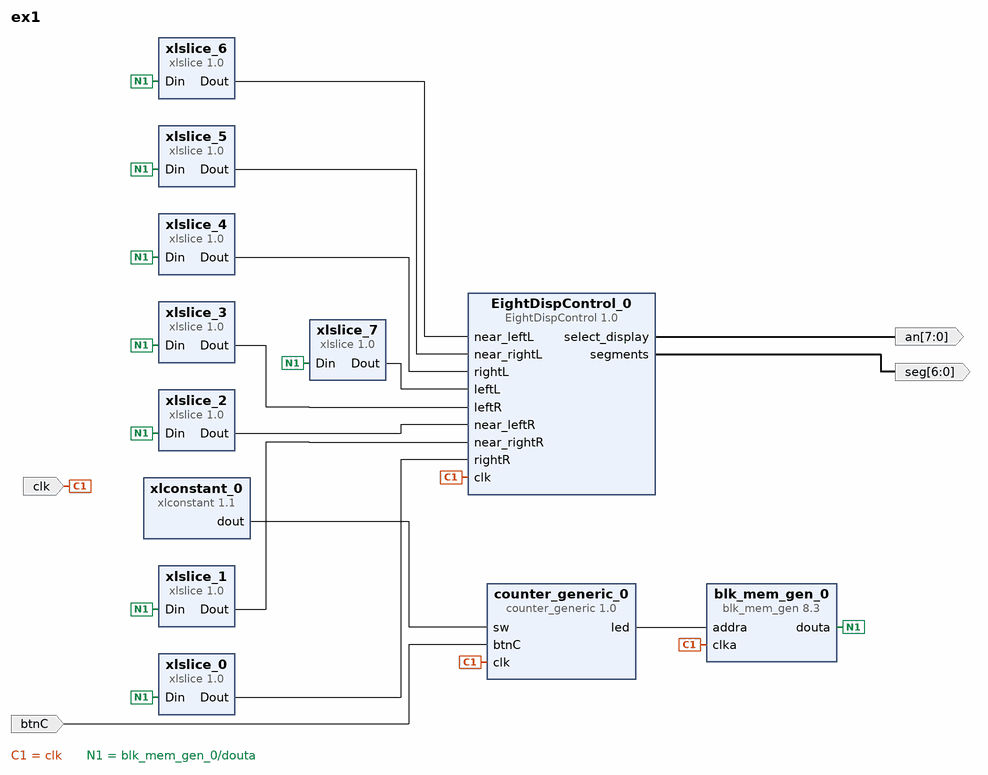
[diagram p0: block diagram of the top level]
# Vivado block design ex1, xc7a100tcsg324-3, Vivado 2016.4
create_bd_design ex1

create_bd_port -dir I clk
create_bd_port -dir I btnC
create_bd_port -dir O -from 6 -to 0 seg
create_bd_port -dir O -from 7 -to 0 an

create_bd_cell -type ip -vlnv xilinx.com:ip:blk_mem_gen:8.3 blk_mem_gen_0
set_property -dict [list \
  CONFIG.Memory_Type Single_Port_ROM \
  CONFIG.Enable_32bit_Address false \
  CONFIG.Write_Width_A 32 \
  CONFIG.Enable_A Always_Enabled \
  CONFIG.Register_PortA_Output_of_Memory_Primitives true \
  CONFIG.Load_Init_File true \
  CONFIG.Coe_File ../../../../../../vector512_random.coe \
  CONFIG.Use_RSTA_Pin false \
  CONFIG.Port_A_Write_Rate 0 \
  CONFIG.use_bram_block Stand_Alone \
] [get_bd_cells blk_mem_gen_0]
create_bd_cell -type ip -vlnv xilinx.com:user:counter_generic:1.0 counter_generic_0
set_property -dict {CONFIG.nr_bits 9} [get_bd_cells counter_generic_0]
create_bd_cell -type ip -vlnv xilinx.com:ip:xlconstant:1.1 xlconstant_0
set_property -dict {CONFIG.CONST_WIDTH 2 CONFIG.CONST_VAL 1} [get_bd_cells xlconstant_0]
create_bd_cell -type ip -vlnv ua.pt:user:EightDispControl:1.0 EightDispControl_0
create_bd_cell -type ip -vlnv xilinx.com:ip:xlslice:1.0 xlslice_0
set_property -dict {CONFIG.DOUT_WIDTH 4 CONFIG.DIN_FROM 3} [get_bd_cells xlslice_0]
create_bd_cell -type ip -vlnv xilinx.com:ip:xlslice:1.0 xlslice_1
set_property -dict {CONFIG.DOUT_WIDTH 4 CONFIG.DIN_TO 4 CONFIG.DIN_FROM 7} [get_bd_cells xlslice_1]
create_bd_cell -type ip -vlnv xilinx.com:ip:xlslice:1.0 xlslice_2
set_property -dict {CONFIG.DOUT_WIDTH 4 CONFIG.DIN_TO 8 CONFIG.DIN_FROM 11} [get_bd_cells xlslice_2]
create_bd_cell -type ip -vlnv xilinx.com:ip:xlslice:1.0 xlslice_3
set_property -dict {CONFIG.DOUT_WIDTH 4 CONFIG.DIN_TO 12 CONFIG.DIN_FROM 15} [get_bd_cells xlslice_3]
create_bd_cell -type ip -vlnv xilinx.com:ip:xlslice:1.0 xlslice_4
set_property -dict {CONFIG.DOUT_WIDTH 4 CONFIG.DIN_TO 16 CONFIG.DIN_FROM 19} [get_bd_cells xlslice_4]
create_bd_cell -type ip -vlnv xilinx.com:ip:xlslice:1.0 xlslice_5
set_property -dict {CONFIG.DOUT_WIDTH 4 CONFIG.DIN_TO 20 CONFIG.DIN_FROM 23} [get_bd_cells xlslice_5]
create_bd_cell -type ip -vlnv xilinx.com:ip:xlslice:1.0 xlslice_6
set_property -dict {CONFIG.DOUT_WIDTH 4 CONFIG.DIN_TO 24 CONFIG.DIN_FROM 27} [get_bd_cells xlslice_6]
create_bd_cell -type ip -vlnv xilinx.com:ip:xlslice:1.0 xlslice_7
set_property -dict {CONFIG.DOUT_WIDTH 4 CONFIG.DIN_TO 28 CONFIG.DIN_FROM 31} [get_bd_cells xlslice_7]

# ---- connections ----

connect_bd_net [get_bd_pins counter_generic_0/led] [get_bd_pins blk_mem_gen_0/addra]
connect_bd_net [get_bd_ports clk] [get_bd_pins counter_generic_0/clk] [get_bd_pins blk_mem_gen_0/clka] [get_bd_pins EightDispControl_0/clk]
connect_bd_net [get_bd_pins xlconstant_0/dout] [get_bd_pins counter_generic_0/sw]
connect_bd_net [get_bd_ports btnC] [get_bd_pins counter_generic_0/btnC]
connect_bd_net [get_bd_pins EightDispControl_0/select_display] [get_bd_ports an]
connect_bd_net [get_bd_pins EightDispControl_0/segments] [get_bd_ports seg]
connect_bd_net [get_bd_pins blk_mem_gen_0/douta] \
  [get_bd_pins xlslice_0/Din] [get_bd_pins xlslice_1/Din] [get_bd_pins xlslice_2/Din] [get_bd_pins xlslice_3/Din] \
  [get_bd_pins xlslice_4/Din] [get_bd_pins xlslice_5/Din] [get_bd_pins xlslice_6/Din] [get_bd_pins xlslice_7/Din]
connect_bd_net [get_bd_pins xlslice_7/Dout] [get_bd_pins EightDispControl_0/leftL]
connect_bd_net [get_bd_pins xlslice_6/Dout] [get_bd_pins EightDispControl_0/near_leftL]
connect_bd_net [get_bd_pins xlslice_5/Dout] [get_bd_pins EightDispControl_0/near_rightL]
connect_bd_net [get_bd_pins xlslice_4/Dout] [get_bd_pins EightDispControl_0/rightL]
connect_bd_net [get_bd_pins xlslice_3/Dout] [get_bd_pins EightDispControl_0/leftR]
connect_bd_net [get_bd_pins xlslice_2/Dout] [get_bd_pins EightDispControl_0/near_leftR]
connect_bd_net [get_bd_pins xlslice_1/Dout] [get_bd_pins EightDispControl_0/near_rightR]
connect_bd_net [get_bd_pins xlslice_0/Dout] [get_bd_pins EightDispControl_0/rightR]

validate_bd_design
save_bd_design
